# EAGLE design dengen1 (EAGLE 9.6.2)
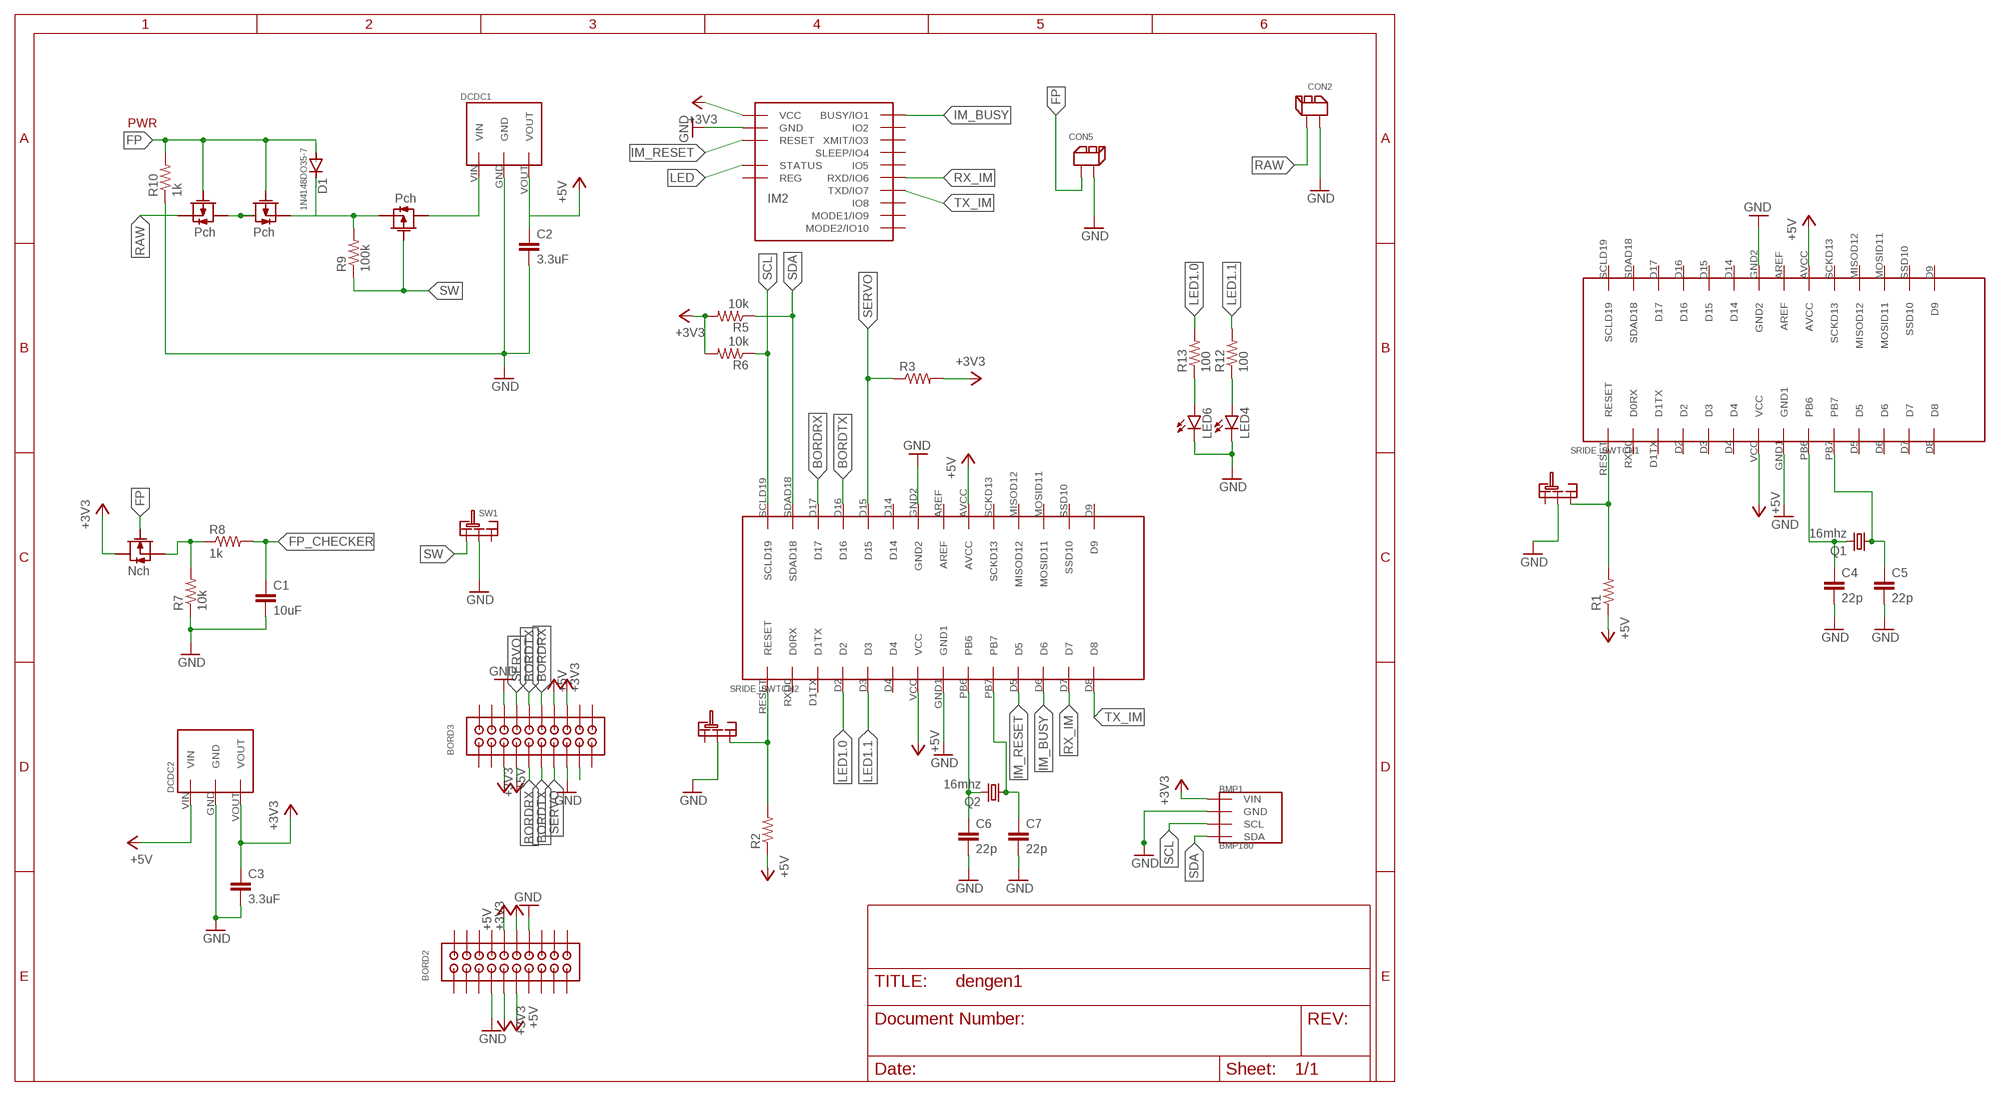
[diagram p0: schematic, sheet 1]

## Parts
BMP1  BMP180  [GY-68]
BORD2  2X10  [2X10]
BORD3  2X10  [2X10]
C1  10uF  C-EU025-024X044  [C025-024X044]
C2  3.3uF  C-EU025-024X044  [C025-024X044]
C3  3.3uF  C-EU025-024X044  [C025-024X044]
C4  22p  C-EU025-024X044  [C025-024X044]
C5  22p  C-EU025-024X044  [C025-024X044]
C6  22p  C-EU025-024X044  [C025-024X044]
C7  22p  C-EU025-024X044  [C025-024X044]
CON2  2PIN  [2PIN]
CON5  2PIN  [2PIN]
D1  1N4148DO35-7  [DO35-7]
DCDC1  5V1A_M78AR05-1  [5V1A_M78AR05-1]
DCDC2  3.3V1A_M78AR033-1  [3.3V1A_M78AR033-1]
IM2  IM920_IM920C  [IM920_IM920C]
LED4  LED5MM  [LED5MM]
LED6  LED5MM  [LED5MM]
Q1  16mhz  CRYSTALHC49S  [HC49/S]
Q2  16mhz  CRYSTALHC49S  [HC49/S]
R1  R-US_0204/7  [0204/7]
R2  R-US_0204/7  [0204/7]
R3  R-US_0204/7  [0204/7]
R5  10k  R-US_0204/7  [0204/7]
R6  10k  R-US_0204/7  [0204/7]
R7  10k  R-US_0204/7  [0204/7]
R8  1k  R-US_0204/7  [0204/7]
R9  100k  R-US_0204/7  [0204/7]
R10  1k  R-US_0204/7  [0204/7]
R12  100  R-US_0204/7  [0204/7]
R13  100  R-US_0204/7  [0204/7]
SRIDE_SWTCH1  SRIDE_SWITCH  [SRIDE_SWITCH]
SRIDE_SWTCH2  SRIDE_SWITCH  [SRIDE_SWITCH]
SW1  SRIDE_SWITCH  [SRIDE_SWITCH]
U$1  ATMEGA238P  [ATMEGA328P]
U$2  2SJ681-PCH  [2SJ681]
U$3  2SK4017-NCH  [2SK4017]
U$4  2SJ681-PCH  [2SJ681]
U$5  2SJ681-PCH  [2SJ681]
U$6  ATMEGA238P  [ATMEGA328P]

## Nets
+3V3 [POWER_L]: BMP1.P1(VIN) BORD2.P$9 BORD2.P$12 BORD3.P$5 BORD3.P$16 C3.1 DCDC2.VOUT IM2.$P17(VCC) R3.2 R5.2 R6.2 U$3.DRAIN
+5V [POWER_H]: BORD2.P$10 BORD2.P$11 BORD3.P$7 BORD3.P$14 C2.1 DCDC1.VOUT DCDC2.VIN R1.1 R2.1 U$1.AVCC U$1.VCC U$6.AVCC U$6.VCC
+5V1 [POWER_H]: DCDC1.VIN U$5.DRAIN
BORDRX [SIGNAL]: BORD3.P$9 BORD3.P$12 U$6.D17
BORDTX [SIGNAL]: BORD3.P$10 BORD3.P$11 U$6.D16
FP [POWER_H]: CON5.P$1 D1.A R10.2 U$2.GATE U$3.GATE U$4.GATE
FP_CHECKER [SIGNAL]: C1.1 R8.2
GND [GND]: BMP1.P2(GND) BORD2.P$7 BORD2.P$14 BORD3.P$6 BORD3.P$15 C1.2 C2.2 C3.2 C4.2 C5.2 C6.2 C7.2 CON2.P$1 CON5.P$2 DCDC1.GND DCDC2.GND IM2.$P18(GND) LED4.K(C) LED6.K(C) R7.1 R10.1 SRIDE_SWTCH1.LR SRIDE_SWTCH2.LR SW1.LR U$1.GND1 U$1.GND2 U$6.GND1 U$6.GND2
IM_BUSY [SIGNAL]: IM2.$P1(BUSY/IO1) U$6.D6
IM_RESET [SIGNAL]: IM2.$P19(RESET) U$6.D5
LED [SIGNAL]: IM2.$P15(STATUS)
LED1.0 [SIGNAL]: R13.2 U$6.D2
LED1.1 [SIGNAL]: R12.2 U$6.D3
N$1 [SIGNAL]: U$2.DRAIN U$4.DRAIN
N$2 [SIGNAL]: C6.1 Q2.2 U$6.PB6
N$3 [SIGNAL]: D1.C R9.2 U$4.SOURCE U$5.SOURCE
N$4 [SIGNAL]: C7.1 Q2.1 U$6.PB7
N$5 [SIGNAL]: C5.1 Q1.1 U$1.PB7
N$6 [SIGNAL]: R1.2 SRIDE_SWTCH1.R U$1.RESET
N$7 [SIGNAL]: C4.1 Q1.2 U$1.PB6
N$8 [SIGNAL]: R2.2 SRIDE_SWTCH2.R U$6.RESET
N$9 [SIGNAL]: LED6.A R13.1
N$10 [SIGNAL]: LED4.A R12.1
N$14 [SIGNAL]: R7.2 R8.1 U$3.SOURCE
N$20 [SIGNAL]: BORD3.P$17
RAW: CON2.P$2 U$2.SOURCE
RX_IM [SIGNAL]: IM2.$P6(RXD/IO6) U$6.D7
SCL [SIGNAL]: BMP1.P3(SCL) R6.1 U$6.SCLD19
SDA [SIGNAL]: BMP1.P4(SDA) R5.1 U$6.SDAD18
SERVO [SIGNAL]: BORD3.P$8 BORD3.P$13 R3.1 U$6.D15
SW [SIGNAL]: R9.1 SW1.L U$5.GATE
TX_IM [SIGNAL]: IM2.$P7(TXD/IO7) U$6.D8
Unconnected: BORD2.P$1 BORD2.P$2 BORD2.P$3 BORD2.P$4 BORD2.P$5 BORD2.P$6 BORD2.P$8 BORD2.P$13 BORD2.P$15 BORD2.P$16 BORD2.P$17 BORD2.P$18 BORD2.P$19 BORD2.P$20 BORD3.P$1 BORD3.P$2 BORD3.P$3 BORD3.P$4 BORD3.P$18 BORD3.P$19 BORD3.P$20 IM2.$P2(IO2) IM2.$P3(XMIT/IO3) IM2.$P4(SLEEP/IO4) IM2.$P5(IO5) IM2.$P8(IO8) IM2.$P9(MODE1/IO9) IM2.$P10(MODE2/IO10) IM2.$P16(REG) SRIDE_SWTCH1.L SRIDE_SWTCH2.L SW1.R U$1.AREF U$1.D1TX U$1.D2 U$1.D3 U$1.D4 U$1.D5 U$1.D6 U$1.D7 U$1.D8 U$1.D9 U$1.D14 U$1.D15 U$1.D16 U$1.D17 U$1.MISOD12 U$1.MOSID11 U$1.RXD0(D0RX) U$1.SCKD13 U$1.SCLD19 U$1.SDAD18 U$1.SSD10 U$6.AREF U$6.D1TX U$6.D4 U$6.D9 U$6.D14 U$6.MISOD12 U$6.MOSID11 U$6.RXD0(D0RX) U$6.SCKD13 U$6.SSD10

## Notes on the sheet
- PWR

## Library data of the parts
BMP1 = BMP180:BMP180
BORD2 BORD3 = PinSocket:2X10
C1-C7 = rcl:C-EU: CAPACITOR, European symbol; SPICEPREFIX: C
CON2 CON5 = XR Connector:2PIN
D1 = diode:1N4148: DIODE high speed (Philips)
DCDC1 = DC-DC:5V1A_M78AR05-1
DCDC2 = DC-DC:3.3V1A_M78AR033-1
IM2 = CANSAT12th:IM920_IM920C
LED4 LED6 = led:LED: LED OSRAM: - CHIPLED LG R971, LG N971, LY N971, LG Q971, LY Q971, LO R971, LY R971 LH N974, LH R974 LS Q976, LO Q976, LY Q976 LO Q996 - Hyper CHIPLED LW Q18S LB Q993, LB Q99A, LB R99A - SideLED LS A670, LO A670, LY A670, LG A670, LP A670 LB A673, LV A673, LT A673, LW A673 LH A674 LY A675 LS A676, LA A676, LO A676, LY A676, LW A676 LS A679, LY A679, LG A679 - Hyper Micro SIDELED® LS Y876, LA Y876, LO Y876, LY Y876 LT Y87S - SmartLED LW L88C, LW L88S LB L89C, LB L89S, LG L890 LS L89K, LO L89K, LY L89K LS L896, LA L896, LO L896, LY L896 - TOPLED LS T670, LO T670, LY T670, LG T670, LP T670 LSG T670, LSP T670, LSY T670, LOP T670, LYG T670 LG T671, LOG T671, LSG T671 LB T673, LV T673, LT T673, LW T673 LH T674 LS T676, LA T676, LO T676, LY T676, LB T676, LH T676, LSB T676, LW T676 LB T67C, LV T67C, LT T67C, LS T67K, LO T67K, LY T67K, LW E67C LS E67B, LA E67B, LO E67B, LY E67B, LB E67C, LV E67C, LT E67C LW T67C LS T679, LY T679, LG T679 LS T770, LO T770, LY T770, LG T770, LP T770 LB T773, LV T773, LT T773, LW T773 LH T774 LS E675, LA E675, LY E675, LS T675 LS T776, LA T776, LO T776, LY T776, LB T776 LHGB T686 LT T68C, LB T68C - Hyper Mini TOPLED® LB M676 - Mini TOPLED Santana® LG M470 LS M47K, LO M47K, LY M47K Source: http://www.osram.convergy.de LUXEON: - LUMILED® LXK2-PW12-R00, LXK2-PW12-S00, LXK2-PW14-U00, LXK2-PW14-V00 LXK2-PM12-R00, LXK2-PM12-S00, LXK2-PM14-U00 LXK2-PE12-Q00, LXK2-PE12-R00, LXK2-PE12-S00, LXK2-PE14-T00, LXK2-PE14-U00 LXK2-PB12-K00, LXK2-PB12-L00, LXK2-PB12-M00, LXK2-PB14-N00, LXK2-PB14-P00, LXK2-PB14-Q00 LXK2-PR12-L00, LXK2-PR12-M00, LXK2-PR14-Q00, LXK2-PR14-R00 LXK2-PD12-Q00, LXK2-PD12-R00, LXK2-PD12-S00 LXK2-PH12-R00, LXK2-PH12-S00 LXK2-PL12-P00, LXK2-PL12-Q00, LXK2-PL12-R00 Source: www.luxeon.com KINGBRIGHT: KA-3528ASYC Source: www.kingbright.com
Q1 Q2 = crystal:CRYSTAL: CRYSTAL; OC_FARNELL: 1667008; OC_NEWARK: unknown
R1-R3 R5-R10 R12 R13 = rcl:R-US_: RESISTOR, American symbol; SPICEPREFIX: R
SRIDE_SWTCH1 SRIDE_SWTCH2 SW1 = Sride Switch:SRIDE_SWITCH
U$1 U$6 = atmega328p:ATMEGA238P
U$2 U$4 U$5 = mosfet:2SJ681-PCH
U$3 = mosfet:2SK4017-NCH

## Net classes
1 SIGNAL: width 0.152 mm, drill 0.152 mm, clearance 0.152 mm
2 POWER_H: width 0.457 mm, drill 0.152 mm, clearance 0.152 mm
3 POWER_L: width 0.305 mm, drill 0.152 mm, clearance 0.152 mm
4 GND: width 0.305 mm, drill 0.152 mm, clearance 0.152 mm

## Board
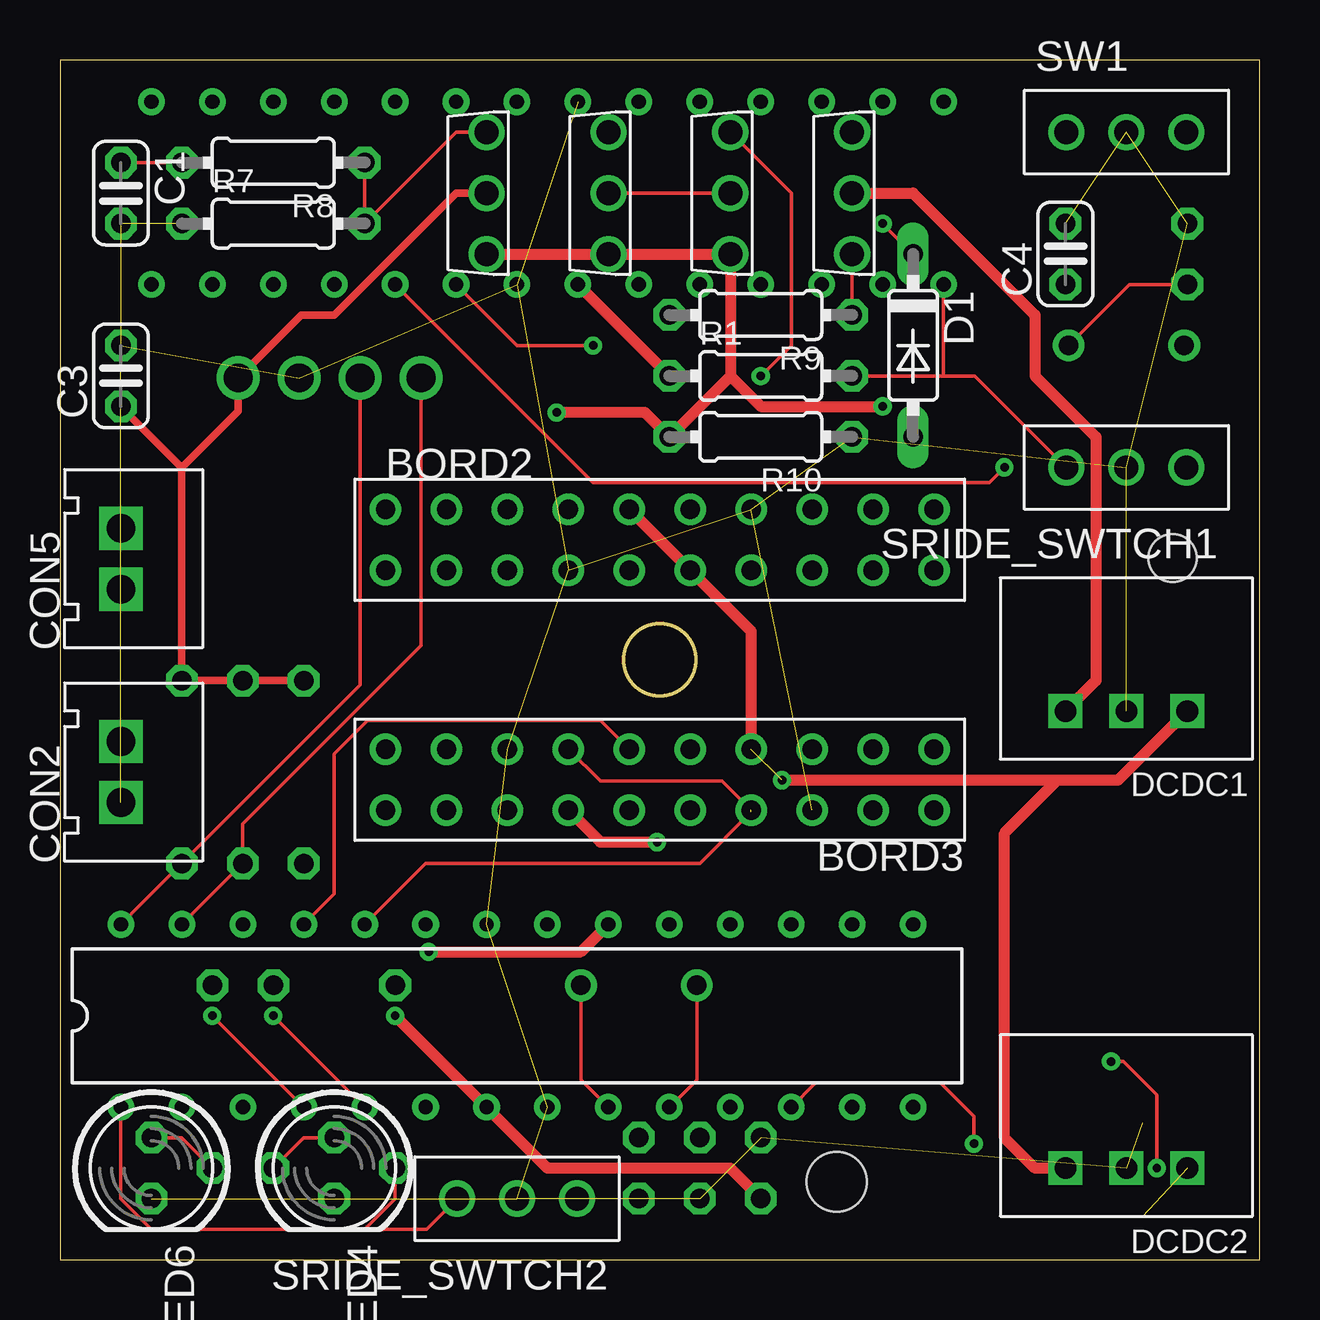
[diagram p1: board, top side]
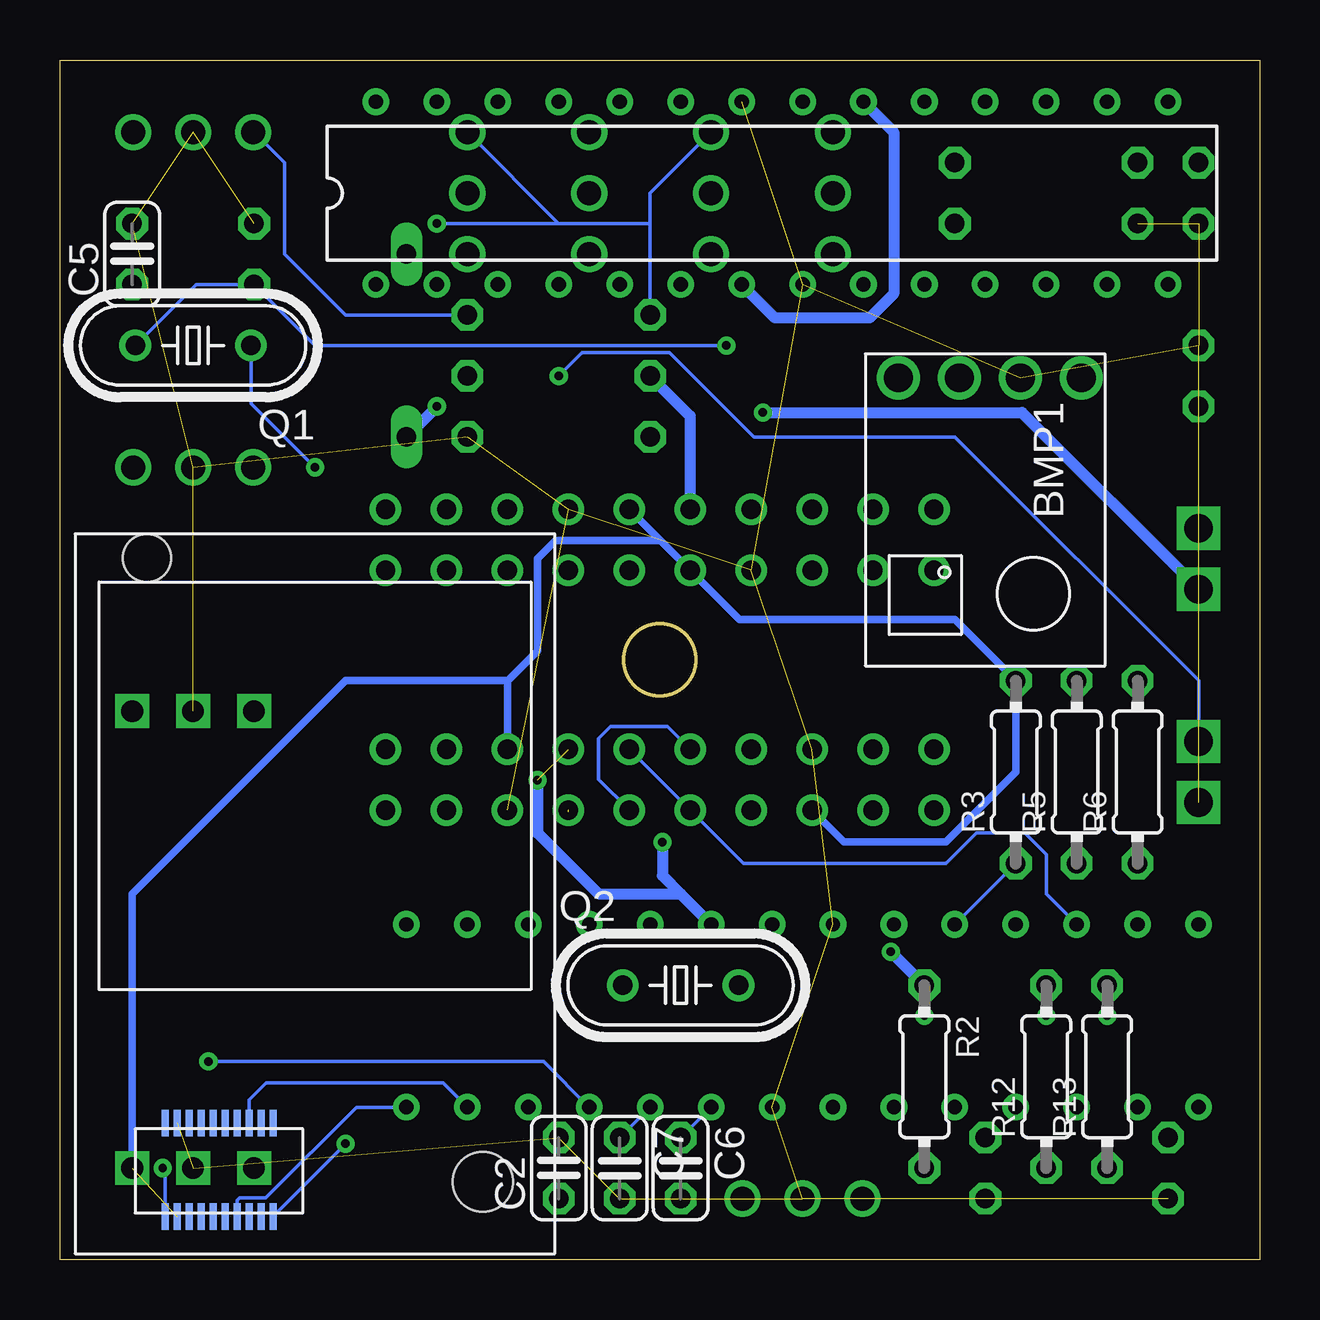
[diagram p2: board, bottom side, seen from below]

Size 50 x 50 mm. Coordinates in mm from the lower left corner, seen from the top.
Outline: 0,0 50,0 50,50 0,50 0,0
Outline: circle at 25,25 radius 1.5
Copper layers (1*16): Top 0.035mm / dielectric 1.5mm / Bottom 0.035mm
Design rules "default": minimum track width 6mil, minimum drill 0.35mm, track to track 6mil, track to pad 6mil, pad to pad 6mil, via to via 6mil, smd to smd 6mil, copper to edge 40mil, drill to drill 6mil, minimum pad ring 10mil, minimum via ring 8mil, stop-mask expansion 4mil, vias tented up to drill 0mil, thermal gap 10mil

### Footprints (pad centres in the part's own frame; a part is rotated, then mirrored left to right if it is on the bottom)
GY-68 = drill 1.2: P1 -5,4; P2 -5,1.46; P3 -5,-1.08; P4 -5,-3.62
2X10 = drill 0.8: P$1 0,1.27; P$2 0,-1.27; P$3 -2.54,1.27; P$4 -2.54,-1.27; P$5 -5.08,1.27; P$6 -5.08,-1.27; P$7 -7.62,1.27; P$8 -7.62,-1.27; P$9 -10.16,1.27; P$10 -10.16,-1.27; P$11 -12.7,1.27; P$12 -12.7,-1.27; P$13 -15.24,1.27; P$14 -15.24,-1.27; P$15 -17.78,1.27; P$16 -17.78,-1.27; P$17 -20.32,1.27; P$18 -20.32,-1.27; P$19 -22.86,1.27; P$20 -22.86,-1.27
C025-024X044 = drill 0.813 octagon: 1 -1.27,0; 2 1.27,0
2PIN = drill 1.2 square: P$1 -1.27,0; P$2 1.27,0
DO35-7 = drill 0.813 long: A 3.81,0; C -3.81,0
5V1A_M78AR05-1 = drill 0.9 pad 1.27 square: GND 0,0; VIN 2.54,0; VOUT -2.54,0
3.3V1A_M78AR033-1 = drill 0.9 pad 1.27 square: GND 0,0; VIN 2.54,0; VOUT -2.54,0
IM920_IM920C = smd 0.3 x 1.1: $P1 -1.75,-13.45; $P2 -1.75,-9.55; $P3 -2.25,-13.45; $P4 -2.25,-9.55; $P5 -2.75,-13.45; $P6 -2.75,-9.55; $P7 -3.25,-13.45; $P8 -3.25,-9.55; $P9 -3.75,-13.45; $P10 -3.75,-9.55; $P11 -4.25,-13.45; $P12 -4.25,-9.55; $P13 -4.75,-13.45; $P14 -4.75,-9.55; $P15 -5.25,-13.45; $P16 -5.25,-9.55; $P17 -5.75,-13.45; $P18 -5.75,-9.55; $P19 -6.25,-13.45; $P20 -6.25,-9.55 | hole 2.5: 7,-12 | hole 2: -7,14
LED5MM = drill 0.813 octagon: A -1.27,0; K 1.27,0
HC49/S = drill 0.813: 1 -2.413,0; 2 2.413,0
0204/7 = drill 0.813 octagon: 1 -3.81,0; 2 3.81,0
SRIDE_SWITCH = drill 1: L -2.5,0; LR 0,0; R 2.5,0
ATMEGA328P = drill 0.6: AREF 17.78,7.62; AVCC 20.32,7.62; D1TX 5.08,0; D2 7.62,0; D3 10.16,0; D4 12.7,0; D5 25.4,0; D6 27.94,0; D7 30.48,0; D8 33.02,0; D9 33.02,7.62; D14 12.7,7.62; D15 10.16,7.62; D16 7.62,7.62; D17 5.08,7.62; GND1 17.78,0; GND2 15.24,7.62; MISOD12 25.4,7.62; MOSID11 27.94,7.62; PB6 20.32,0; PB7 22.86,0; RESET 0,0; RXD0 2.54,0; SCKD13 22.86,7.62; SCLD19 0,7.62; SDAD18 2.54,7.62; SSD10 30.48,7.62; VCC 15.24,0
2SJ681 = drill 1: DRAIN 0,0; GATE 2.54,0; SOURCE -2.54,0
2SK4017 = drill 1: DRAIN 0,0; GATE 2.54,0; SOURCE -2.54,0

### Placement (x,y rotation side)
BMP1  11.43,31.75 270 bottom
BORD2  36.43,30 0 top
BORD3  13.57,20 180 top
C1  2.54,44.45 270 top
C2  29.21,3.81 90 bottom
C3  2.54,36.83 90 top
C4  41.91,41.91 90 top
C5  46.99,41.91 90 bottom
C6  24.13,3.81 270 bottom
C7  26.67,3.81 270 bottom
CON2  2.54,20.32 90 top
CON5  2.54,29.21 90 top
D1  35.56,38.1 270 top
DCDC1  44.45,22.86 180 top
DCDC2  44.45,3.81 180 top
IM2  39.37,15.24 0 bottom
LED4  11.43,3.81 270 top
LED6  3.81,3.81 270 top
Q1  44.45,38.1 180 bottom
Q2  24.13,11.43 0 bottom
R1  29.21,36.83 0 top
R2  13.97,7.62 270 bottom
R3  10.16,20.32 90 bottom
R5  7.62,20.32 90 bottom
R6  5.08,20.32 90 bottom
R7  8.89,43.18 0 top
R8  8.89,45.72 180 top
R9  29.21,39.37 180 top
R10  29.21,34.29 180 top
R12  8.89,7.62 90 bottom
R13  6.35,7.62 90 bottom
SRIDE_SWTCH1  44.45,33.02 180 top
SRIDE_SWTCH2  19.05,2.54 180 top
SW1  44.45,46.99 0 top
U$1  36.83,40.64 0 bottom
U$2  27.94,44.45 270 top
U$3  17.78,44.45 270 top
U$4  22.86,44.45 270 top
U$5  33.02,44.45 270 top
U$6  2.54,6.35 0 top

### Tracks (layer width: path | path; a pad name or v marks a point on that pad's centre or on a via)
+3V3  (1 unrouted)
  Top 0.305: R3.2 R5.2 R6.2 5.08,33.02 | C3.1 5.08,33.02 | 5.08,33.02 7.43,35.37 BMP1.P1 10.05,39.37 11.43,39.37 16.51,44.45 U$3.DRAIN
  Bottom 0.305: DCDC2.VOUT 46.99,15.24 38.1,24.13 31.37,24.13 31.35,24.11 | 31.35,24.11 30.1,25.36 30.1,29.21 29.34,29.97 24.97,29.97 | BORD3.P$5 17.32,17.4 13.08,17.4 10.16,20.32 R3.2 12.7,26.67 21.67,26.67 BORD2.P$12 24.97,29.97 | BORD3.P$16 31.35,24.11 | BORD2.P$9 24.97,29.97
+5V  (via drill 0.35)  (1 unrouted)
  Top 0.457: R1.1 U$1.VCC | v30.1,19.98 41.57,19.98 | 41.57,19.98 44.11,19.98 DCDC1.VOUT | U$6.AVCC 21.72,12.83 v15.37,12.83 | v13.97,10.16 U$6.VCC 20.32,3.81 27.94,3.81 C2.1 | DCDC2.VIN 40.64,3.81 39.37,5.08 39.37,17.78 41.57,19.98 | BORD3.P$7 22.52,17.4 v24.89,17.4 | BORD3.P$14 28.81,26.19 BORD2.P$10 BORD2.P$11
  Bottom 0.457: v30.1,19.98 30.1,17.78 27.56,15.24 24.13,15.24 | 24.13,15.24 U$6.AVCC | v15.37,12.83 R2.1 v13.97,10.16 | U$1.AVCC 15.24,46.99 15.24,40.26 16.26,39.24 20.19,39.24 U$1.VCC | v24.89,17.4 24.89,16 24.13,15.24 | BORD2.P$11 23.73,35.16 R1.1
+5V1
  Top 0.457: DCDC1.VIN 43.18,24.13 43.18,34.29 40.64,36.83 40.64,39.37 35.56,44.45 U$5.DRAIN
BORDRX
  Bottom 0.152: U$6.D17 8.89,15.24 8.89,16.89 9.78,17.78 11.81,17.78 13.08,16.51 21.51,16.51 BORD3.P$9 BORD3.P$12
BORDTX
  Top 0.152: U$6.D16 11.43,15.24 11.43,21.08 12.83,22.48 22.52,22.48 BORD3.P$10
  Bottom 0.152: BORD3.P$10 24.68,22.23 27.05,22.23 27.56,21.72 27.56,20.02 BORD3.P$11
FP  (via drill 0.35)
  Top 0.457: 27.94,36.83 U$2.GATE U$4.GATE U$3.GATE | 27.94,36.83 R10.2 24.38,35.31 v20.7,35.31 | 27.94,36.83 29.21,35.56 v34.29,35.56
  Bottom 0.457: v34.29,35.56 D1.A | v20.7,35.31 9.91,35.31 CON5.P$1
FP_CHECKER
  Top 0.152: C1.1 R8.2
GND  (27 unrouted)
IM_BUSY  (via drill 0.35)
  Top 0.152: U$6.D6 31.5,7.37 36.7,7.37 38.1,5.97 v38.1,4.83
  Bottom 0.152: v38.1,4.83 41.12,1.81 IM2.$P1
IM_RESET  (via drill 0.35)
  Top 0.152: v43.81,8.26 44.32,8.26 45.72,6.86 v45.72,3.81
  Bottom 0.152: U$6.D5 29.84,8.26 v43.81,8.26 | v45.72,3.81 45.62,3.71 IM2.$P19
LED1.0  (via drill 0.35)
  Top 0.152: U$6.D2 v6.35,10.16
  Bottom 0.152: v6.35,10.16 R13.2
LED1.1  (via drill 0.35)
  Top 0.152: v8.89,10.16 U$6.D3
  Bottom 0.152: R12.2 v8.89,10.16
N$1
  Top 0.152: U$4.DRAIN U$2.DRAIN
N$2
  Top 0.152: Q2.2 21.72,7.49 U$6.PB6
  Bottom 0.152: U$6.PB6 C6.1
N$3  (via drill 0.35)
  Top 0.152: v34.29,43.18 D1.C
  Bottom 0.152: U$4.SOURCE 25.4,44.45 25.4,43.18 | 25.4,43.18 R9.2 | 25.4,43.18 29.21,43.18 | U$5.SOURCE 29.21,43.18 | 29.21,43.18 v34.29,43.18
N$4
  Top 0.152: Q2.1 26.54,7.49 U$6.PB7
  Bottom 0.152: U$6.PB7 C7.1
N$5  (via drill 0.35)
  Top 0.152: Q1.1 44.58,40.64 C5.1 | U$1.PB7 22.23,32.38 38.73,32.38 v39.37,33.02
  Bottom 0.152: Q1.1 42.04,35.69 v39.37,33.02
N$6
  Top 0.152: R1.2 36.83,36.83 | 36.83,36.83 U$1.RESET | 36.83,36.83 38.14,36.83 SRIDE_SWTCH1.R
N$7  (via drill 0.35)
  Top 0.152: U$1.PB6 19.05,38.1 v22.23,38.1
  Bottom 0.152: Q1.2 44.32,40.64 C4.1 39.37,38.1 v22.23,38.1
N$8
  Top 0.152: U$6.RESET 2.54,2.54 3.81,1.27 12.7,1.27 | R2.2 13.97,2.54 12.7,1.27 | 12.7,1.27 15.28,1.27 SRIDE_SWTCH2.R
N$9
  Top 0.152: LED6.A 5.08,5.08 R13.1
N$10
  Top 0.152: R12.1 10.16,5.08 LED4.A
N$14
  Top 0.152: R8.1 R7.2 16.51,46.99 U$3.SOURCE
RAW  (via drill 0.35)
  Top 0.152: v29.21,36.83 30.48,38.1 30.48,44.45 U$2.SOURCE
  Bottom 0.152: CON2.P$2 2.54,24.13 12.7,34.29 21.08,34.29 24.51,37.72 24.59,37.8 28.25,37.8 v29.21,36.83
RX_IM
  Bottom 0.152: U$6.D7 34.04,7.37 41.4,7.37 42.12,6.65 IM2.$P6
SCL
  Top 0.152: U$6.SCLD19 R6.1 12.51,23.94 BMP1.P3
SDA
  Top 0.152: U$6.SDAD18 R5.1 7.62,18.16 15.05,25.59 BMP1.P4
SERVO  (1 unrouted)
  Top 0.152: U$6.D15 15.24,16.51 26.67,16.51 28.81,18.65 | BORD3.P$8 22.52,19.94 27.6,19.94 BORD3.P$13
  Bottom 0.152: R3.1 U$6.D15
SW
  Top 0.152: R9.1 U$5.GATE
  Bottom 0.152: R9.1 38.1,39.37 40.64,41.91 40.64,45.72 41.91,46.99 SW1.L
TX_IM
  Bottom 0.152: U$6.D8 37.64,6.35 41.42,2.57 42.52,2.57 42.62,2.46 IM2.$P7